# EAGLE schematic Gambar Teknik (EAGLE 9.6.2)
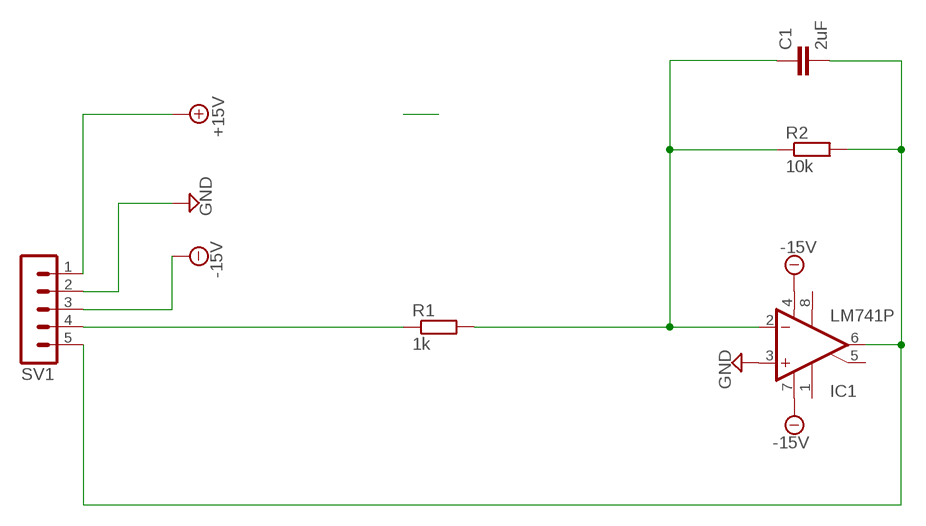
[diagram p0: schematic, sheet 1]

## Parts
C1  2uF  C-EUC0603  [C0603]
IC1  LM741P  [DIL08]
R1  1k  R-EU_0204/7  [0204/7]
R2  10k  R-EU_0204/7  [0204/7]
SV1  MA05-1  [MA05-1]

## Nets
+15V: SV1.1
-15V: IC1.3(+IN) IC1.4(V-) IC1.5(ON2) IC1.7(V+) SV1.3 ; supply symbol labelled GND
GND: SV1.2
N$1: C1.1 IC1.2(-IN) R1.2 R2.1
N$2: C1.2 IC1.6(OUT) R2.2 SV1.5
N$3: R1.1 SV1.4
Unconnected: IC1.1(ON1) IC1.8(OPT)

## Library data of the parts
C1 = rcl:C-EU: CAPACITOR, European symbol; SPICEPREFIX: C
IC1 = linear:*741: OP AMP
R1 R2 = rcl:R-EU_: RESISTOR, European symbol; SPICEPREFIX: R
SV1 = con-lstb:MA05-1: PIN HEADER; OC_FARNELL: unknown; OC_NEWARK: unknown